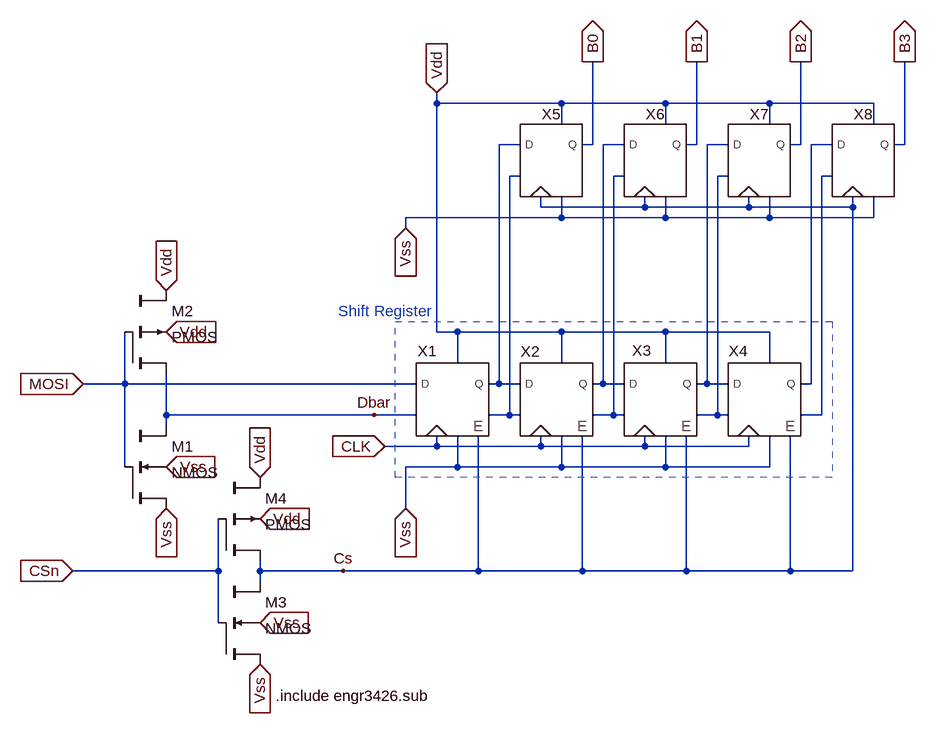
[diagram p0: schematic spi-interface.asc]
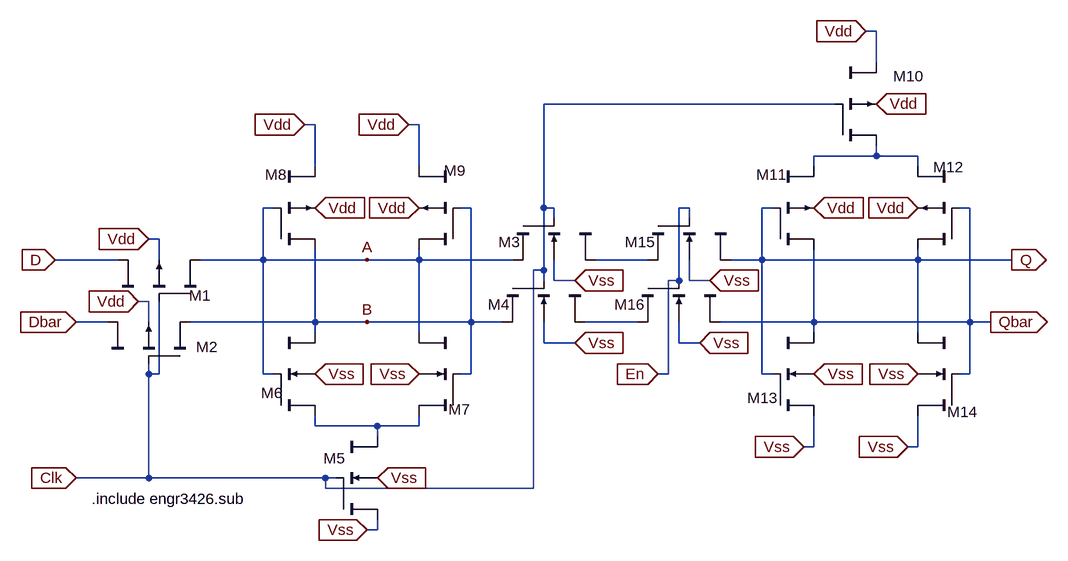
[diagram p1: sub-circuit dflipflop.asc]
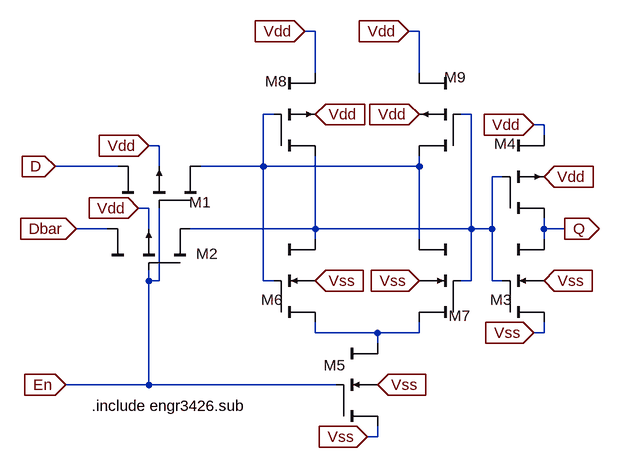
[diagram p2: sub-circuit dflipflopsimple.asc]
spi-interface.asc, the LTspice schematic file:
Version 4
SHEET 1 2428 892
WIRE 240 -272 240 -288
WIRE 432 -272 240 -272
WIRE 592 -272 432 -272
WIRE 752 -272 592 -272
WIRE 912 -272 752 -272
WIRE 432 -240 432 -272
WIRE 592 -240 592 -272
WIRE 752 -240 752 -272
WIRE 912 -240 912 -272
WIRE 368 -208 336 -208
WIRE 480 -208 480 -336
WIRE 480 -208 464 -208
WIRE 528 -208 496 -208
WIRE 640 -208 640 -336
WIRE 640 -208 624 -208
WIRE 688 -208 656 -208
WIRE 800 -208 800 -336
WIRE 800 -208 784 -208
WIRE 848 -208 816 -208
WIRE 960 -208 960 -336
WIRE 960 -208 944 -208
WIRE 368 -160 352 -160
WIRE 528 -160 512 -160
WIRE 688 -160 672 -160
WIRE 848 -160 832 -160
WIRE 400 -112 400 -128
WIRE 560 -112 560 -128
WIRE 560 -112 400 -112
WIRE 720 -112 720 -128
WIRE 720 -112 560 -112
WIRE 880 -112 880 -128
WIRE 880 -112 720 -112
WIRE 432 -96 432 -128
WIRE 432 -96 192 -96
WIRE 592 -96 592 -128
WIRE 592 -96 432 -96
WIRE 752 -96 752 -128
WIRE 752 -96 592 -96
WIRE 912 -96 912 -128
WIRE 912 -96 752 -96
WIRE 192 -80 192 -96
WIRE 240 80 240 -272
WIRE 272 80 240 80
WIRE 432 80 272 80
WIRE 592 80 432 80
WIRE 752 80 592 80
WIRE 272 128 272 80
WIRE 432 128 432 80
WIRE 592 128 592 80
WIRE 752 128 752 80
WIRE -240 160 -240 80
WIRE -240 160 -304 160
WIRE 208 160 -240 160
WIRE 336 160 336 -208
WIRE 336 160 320 160
WIRE 368 160 336 160
WIRE 496 160 496 -208
WIRE 496 160 480 160
WIRE 528 160 496 160
WIRE 656 160 656 -208
WIRE 656 160 640 160
WIRE 688 160 656 160
WIRE 816 160 816 -208
WIRE 816 160 800 160
WIRE -176 208 -176 144
WIRE 144 208 -176 208
WIRE 208 208 144 208
WIRE 352 208 352 -160
WIRE 352 208 320 208
WIRE 368 208 352 208
WIRE 512 208 512 -160
WIRE 512 208 480 208
WIRE 528 208 512 208
WIRE 672 208 672 -160
WIRE 672 208 640 208
WIRE 688 208 672 208
WIRE 832 208 832 -160
WIRE 832 208 800 208
WIRE -176 224 -176 208
WIRE 240 256 240 240
WIRE 240 256 160 256
WIRE 400 256 400 240
WIRE 400 256 240 256
WIRE 560 256 560 240
WIRE 560 256 400 256
WIRE 720 256 720 240
WIRE 720 256 560 256
WIRE -240 288 -240 160
WIRE 272 288 272 240
WIRE 272 288 192 288
WIRE 432 288 432 240
WIRE 432 288 272 288
WIRE 592 288 592 240
WIRE 592 288 432 288
WIRE 752 288 752 240
WIRE 752 288 592 288
WIRE 192 352 192 288
WIRE -96 448 -96 368
WIRE -96 448 -320 448
WIRE -32 448 -32 432
WIRE 96 448 -32 448
WIRE 304 448 304 240
WIRE 304 448 96 448
WIRE 464 448 464 240
WIRE 464 448 304 448
WIRE 624 448 624 240
WIRE 624 448 464 448
WIRE 784 448 784 240
WIRE 784 448 624 448
WIRE 880 448 880 -112
WIRE 880 448 784 448
WIRE -32 464 -32 448
WIRE -96 528 -96 448
FLAG 144 208 Dbar
FLAG 192 352 Vss
IOPIN 192 352 In
FLAG 240 -288 Vdd
IOPIN 240 -288 In
FLAG -304 160 MOSI
IOPIN -304 160 In
FLAG 160 256 CLK
IOPIN 160 256 In
FLAG -176 352 Vss
IOPIN -176 352 In
FLAG -176 288 Vss
IOPIN -176 288 In
FLAG -176 80 Vdd
IOPIN -176 80 In
FLAG -176 16 Vdd
IOPIN -176 16 In
FLAG 480 -336 B0
IOPIN 480 -336 Out
FLAG 640 -336 B1
IOPIN 640 -336 Out
FLAG 800 -336 B2
IOPIN 800 -336 Out
FLAG 960 -336 B3
IOPIN 960 -336 Out
FLAG -32 592 Vss
IOPIN -32 592 In
FLAG -32 528 Vss
IOPIN -32 528 In
FLAG -32 368 Vdd
IOPIN -32 368 In
FLAG -32 304 Vdd
IOPIN -32 304 In
FLAG -320 448 CSn
IOPIN -320 448 In
FLAG 192 -80 Vss
IOPIN 192 -80 In
FLAG 96 448 Cs
SYMBOL dflipflop 432 192 R0
WINDOW 0 -48 -66 Bottom 2
SYMATTR InstName X2
SYMBOL dflipflop 272 192 R0
WINDOW 0 -47 -67 Bottom 2
SYMATTR InstName X1
SYMBOL dflipflop 592 192 R0
WINDOW 0 -37 -68 Bottom 2
SYMATTR InstName X3
SYMBOL dflipflop 752 192 R0
WINDOW 0 -48 -67 Bottom 2
SYMATTR InstName X4
SYMBOL cktsym\\nmos4 -176 288 R0
SYMATTR InstName M1
SYMATTR Value2 l=.6u w=1.2u
SYMBOL cktsym\\pmos4 -176 80 R0
SYMATTR InstName M2
SYMATTR Value2 l=.6u w=1.2u
SYMBOL cktsym\\nmos4 -32 528 R0
SYMATTR InstName M3
SYMATTR Value2 l=.6u w=1.2u
SYMBOL cktsym\\pmos4 -32 368 R0
SYMATTR InstName M4
SYMATTR Value2 l=.6u w=1.2u
SYMBOL dflipflopsimple 432 -176 R0
SYMATTR InstName X5
SYMBOL dflipflopsimple 592 -176 R0
SYMATTR InstName X6
SYMBOL dflipflopsimple 752 -176 R0
SYMATTR InstName X7
SYMBOL dflipflopsimple 912 -176 R0
SYMATTR InstName X8
TEXT -8 640 Left 2 !.include engr3426.sub
TEXT 88 48 Left 2 ;Shift Register
RECTANGLE Normal 848 304 176 64 2

dflipflop.asc, the sub-circuit schematic file:
Version 4
SHEET 1 1276 680
WIRE 976 -432 960 -432
WIRE 976 -384 976 -432
WIRE 912 -320 464 -320
WIRE 112 -288 96 -288
WIRE 272 -288 256 -288
WIRE 976 -240 976 -256
WIRE 976 -240 880 -240
WIRE 1040 -240 976 -240
WIRE 112 -224 112 -288
WIRE 272 -224 272 -288
WIRE 880 -224 880 -240
WIRE 1040 -224 1040 -240
WIRE 48 -160 32 -160
WIRE 352 -160 336 -160
WIRE 464 -160 464 -320
WIRE 480 -160 464 -160
WIRE 688 -160 672 -160
WIRE 816 -160 800 -160
WIRE 1120 -160 1104 -160
WIRE 480 -144 480 -160
WIRE 688 -144 688 -160
WIRE -128 -112 -144 -112
WIRE -192 -80 -288 -80
WIRE -128 -80 -128 -112
WIRE 32 -80 32 -160
WIRE 32 -80 -64 -80
WIRE 192 -80 32 -80
WIRE 272 -80 272 -96
WIRE 272 -80 192 -80
WIRE 416 -80 272 -80
WIRE 624 -80 544 -80
WIRE 800 -80 800 -160
WIRE 800 -80 752 -80
WIRE 1040 -80 1040 -96
WIRE 1040 -80 800 -80
WIRE 1184 -80 1040 -80
WIRE 464 -64 464 -160
WIRE 464 -64 448 -64
WIRE 464 -48 464 -64
WIRE 480 -48 480 -80
WIRE 512 -48 480 -48
WIRE 672 -48 672 -160
WIRE 672 -48 656 -48
WIRE 688 -48 688 -80
WIRE 720 -48 688 -48
WIRE -144 -16 -160 -16
WIRE -208 16 -256 16
WIRE -144 16 -144 -16
WIRE 112 16 112 -96
WIRE 112 16 -80 16
WIRE 192 16 112 16
WIRE 352 16 352 -160
WIRE 352 16 192 16
WIRE 400 16 352 16
WIRE 608 16 528 16
WIRE 880 16 880 -96
WIRE 880 16 736 16
WIRE 1120 16 1120 -160
WIRE 1120 16 880 16
WIRE 1152 16 1120 16
WIRE 112 32 112 16
WIRE 272 32 272 -80
WIRE 880 32 880 16
WIRE 1040 32 1040 -80
WIRE 464 48 464 16
WIRE 512 48 464 48
WIRE 672 48 672 16
WIRE 704 48 672 48
WIRE -144 96 -144 80
WIRE -128 96 -128 -16
WIRE -128 96 -144 96
WIRE 32 96 32 -80
WIRE 48 96 32 96
WIRE 352 96 352 16
WIRE 352 96 336 96
WIRE 656 96 656 -48
WIRE 656 96 640 96
WIRE 800 96 800 -80
WIRE 816 96 800 96
WIRE 1120 96 1120 16
WIRE 1120 96 1104 96
WIRE 112 176 112 160
WIRE 208 176 112 176
WIRE 272 176 272 160
WIRE 272 176 208 176
WIRE 208 192 208 176
WIRE 880 208 880 160
WIRE 880 208 864 208
WIRE 1040 208 1040 160
WIRE 1040 208 1024 208
WIRE -144 256 -144 96
WIRE -144 256 -256 256
WIRE 128 256 -144 256
WIRE 144 256 128 256
WIRE 128 272 128 256
WIRE 448 272 448 -64
WIRE 448 272 128 272
WIRE 208 336 208 320
WIRE 208 336 192 336
FLAG 256 -288 Vdd
IOPIN 256 -288 In
FLAG 96 -288 Vdd
IOPIN 96 -288 In
FLAG 192 336 Vss
IOPIN 192 336 In
FLAG 272 96 Vss
IOPIN 272 96 In
FLAG 112 96 Vss
IOPIN 112 96 In
FLAG 272 -160 Vdd
IOPIN 272 -160 In
FLAG 112 -160 Vdd
IOPIN 112 -160 In
FLAG 208 256 Vss
IOPIN 208 256 In
FLAG -144 -112 Vdd
IOPIN -144 -112 In
FLAG -160 -16 Vdd
IOPIN -160 -16 In
FLAG 512 -48 Vss
IOPIN 512 -48 In
FLAG 512 48 Vss
IOPIN 512 48 In
FLAG 1040 96 Vss
IOPIN 1040 96 In
FLAG 880 96 Vss
IOPIN 880 96 In
FLAG 1040 -160 Vdd
IOPIN 1040 -160 In
FLAG 880 -160 Vdd
IOPIN 880 -160 In
FLAG 976 -320 Vdd
IOPIN 976 -320 In
FLAG 960 -432 Vdd
IOPIN 960 -432 In
FLAG -288 -80 D
IOPIN -288 -80 In
FLAG -256 16 Dbar
IOPIN -256 16 In
FLAG 1184 -80 Q
IOPIN 1184 -80 Out
FLAG 1152 16 Qbar
IOPIN 1152 16 Out
FLAG -256 256 Clk
IOPIN -256 256 In
FLAG 864 208 Vss
IOPIN 864 208 In
FLAG 1024 208 Vss
IOPIN 1024 208 In
FLAG 192 -80 A
FLAG 192 16 B
FLAG 720 -48 Vss
IOPIN 720 -48 In
FLAG 704 48 Vss
IOPIN 704 48 In
FLAG 640 96 En
IOPIN 640 96 In
SYMBOL cktsym\\pmos4 -144 16 R270
WINDOW 0 -38 73 VRight 2
WINDOW 3 16 16 Invisible 2
SYMATTR InstName M2
SYMATTR Value2 l=.6u w=1.2u
SYMBOL cktsym\\pmos4 -128 -80 R270
WINDOW 0 -55 46 VRight 2
WINDOW 3 16 16 Invisible 2
SYMATTR InstName M1
SYMATTR Value2 l=.6u w=1.2u
SYMBOL cktsym\\nmos4 464 16 R90
WINDOW 0 -27 52 VRight 2
WINDOW 3 16 16 Invisible 2
SYMATTR InstName M4
SYMATTR Value2 l=2.4u w=1.2u
SYMBOL cktsym\\nmos4 208 256 R0
WINDOW 0 -83 -30 Left 2
WINDOW 3 16 16 Invisible 2
SYMATTR InstName M5
SYMATTR Value2 l=.6u w=1.2u
SYMBOL cktsym\\nmos4 112 96 R0
WINDOW 0 -83 29 Left 2
WINDOW 3 16 16 Invisible 2
SYMATTR InstName M6
SYMATTR Value2 l=.6u w=1.2u
SYMBOL cktsym\\nmos4 272 96 M0
WINDOW 0 -79 54 Left 2
WINDOW 3 16 16 Invisible 2
SYMATTR InstName M7
SYMATTR Value2 l=.6u w=1.2u
SYMBOL cktsym\\pmos4 112 -160 R0
WINDOW 0 -77 -51 Left 2
WINDOW 3 16 16 Invisible 2
SYMATTR InstName M8
SYMATTR Value2 l=.6u w=1.2u
SYMBOL cktsym\\pmos4 272 -160 M0
WINDOW 0 -72 -57 Left 2
WINDOW 3 16 16 Invisible 2
SYMATTR InstName M9
SYMATTR Value2 l=.6u w=1.2u
SYMBOL cktsym\\pmos4 976 -320 R0
WINDOW 0 26 -43 Left 2
WINDOW 3 16 16 Invisible 2
SYMATTR InstName M10
SYMATTR Value2 l=.6u w=1.2u
SYMBOL cktsym\\nmos4 880 96 R0
WINDOW 0 -103 37 Left 2
WINDOW 3 16 16 Invisible 2
SYMATTR InstName M13
SYMATTR Value2 l=.6u w=1.2u
SYMBOL cktsym\\nmos4 1040 96 M0
WINDOW 0 -92 58 Left 2
WINDOW 3 16 16 Invisible 2
SYMATTR InstName M14
SYMATTR Value2 l=.6u w=1.2u
SYMBOL cktsym\\pmos4 880 -160 R0
WINDOW 0 -89 -51 Left 2
WINDOW 3 16 16 Invisible 2
SYMATTR InstName M11
SYMATTR Value2 l=.6u w=1.2u
SYMBOL cktsym\\pmos4 1040 -160 M0
WINDOW 0 -71 -63 Left 2
WINDOW 3 16 16 Invisible 2
SYMATTR InstName M12
SYMATTR Value2 l=.6u w=1.2u
SYMBOL cktsym\\nmos4 480 -80 R90
WINDOW 0 -27 52 VRight 2
WINDOW 3 16 16 Invisible 2
SYMATTR InstName M3
SYMATTR Value2 l=2.4u w=1.2u
SYMBOL cktsym\\nmos4 688 -80 R90
WINDOW 0 -27 52 VRight 2
WINDOW 3 16 16 Invisible 2
SYMATTR InstName M15
SYMATTR Value2 l=2.4u w=1.2u
SYMBOL cktsym\\nmos4 672 16 R90
WINDOW 0 -27 52 VRight 2
WINDOW 3 16 16 Invisible 2
SYMATTR InstName M16
SYMATTR Value2 l=2.4u w=1.2u
TEXT -232 288 Left 2 !.include engr3426.sub

dflipflopsimple.asc, the sub-circuit schematic file:
Version 4
SHEET 1 1276 680
WIRE 112 -288 96 -288
WIRE 272 -288 256 -288
WIRE 112 -224 112 -288
WIRE 272 -224 272 -288
WIRE 48 -160 32 -160
WIRE 352 -160 336 -160
WIRE 464 -144 448 -144
WIRE 464 -128 464 -144
WIRE -128 -112 -144 -112
WIRE -192 -80 -288 -80
WIRE -128 -80 -128 -112
WIRE 32 -80 32 -160
WIRE 32 -80 -64 -80
WIRE 272 -80 272 -96
WIRE 272 -80 32 -80
WIRE 400 -64 384 -64
WIRE -144 -16 -160 -16
WIRE -208 16 -256 16
WIRE -144 16 -144 -16
WIRE 112 16 112 -96
WIRE 112 16 -80 16
WIRE 352 16 352 -160
WIRE 352 16 112 16
WIRE 384 16 384 -64
WIRE 384 16 352 16
WIRE 464 16 464 0
WIRE 496 16 464 16
WIRE 112 32 112 16
WIRE 272 32 272 -80
WIRE 464 32 464 16
WIRE -144 96 -144 80
WIRE -128 96 -128 -16
WIRE -128 96 -144 96
WIRE 32 96 32 -80
WIRE 48 96 32 96
WIRE 352 96 352 16
WIRE 352 96 336 96
WIRE 384 96 384 16
WIRE 400 96 384 96
WIRE 112 176 112 160
WIRE 208 176 112 176
WIRE 272 176 272 160
WIRE 272 176 208 176
WIRE 464 176 464 160
WIRE 464 176 448 176
WIRE 208 192 208 176
WIRE -144 256 -144 96
WIRE -144 256 -272 256
WIRE 144 256 -144 256
WIRE 208 336 208 320
WIRE 208 336 192 336
FLAG 256 -288 Vdd
IOPIN 256 -288 In
FLAG 96 -288 Vdd
IOPIN 96 -288 In
FLAG 192 336 Vss
IOPIN 192 336 In
FLAG 272 96 Vss
IOPIN 272 96 In
FLAG 112 96 Vss
IOPIN 112 96 In
FLAG 272 -160 Vdd
IOPIN 272 -160 In
FLAG 112 -160 Vdd
IOPIN 112 -160 In
FLAG 208 256 Vss
IOPIN 208 256 In
FLAG -144 -112 Vdd
IOPIN -144 -112 In
FLAG -160 -16 Vdd
IOPIN -160 -16 In
FLAG -288 -80 D
IOPIN -288 -80 In
FLAG -256 16 Dbar
IOPIN -256 16 In
FLAG 496 16 Q
IOPIN 496 16 Out
FLAG -272 256 En
IOPIN -272 256 In
FLAG 464 96 Vss
IOPIN 464 96 In
FLAG 464 -64 Vdd
IOPIN 464 -64 In
FLAG 448 -144 Vdd
IOPIN 448 -144 In
FLAG 448 176 Vss
IOPIN 448 176 In
SYMBOL cktsym\\pmos4 -144 16 R270
WINDOW 0 -38 73 VRight 2
WINDOW 3 16 16 Invisible 2
SYMATTR InstName M2
SYMATTR Value2 l=.6u w=1.2u
SYMBOL cktsym\\pmos4 -128 -80 R270
WINDOW 0 -55 46 VRight 2
WINDOW 3 16 16 Invisible 2
SYMATTR InstName M1
SYMATTR Value2 l=.6u w=1.2u
SYMBOL cktsym\\nmos4 208 256 R0
WINDOW 0 -83 -30 Left 2
WINDOW 3 16 16 Invisible 2
SYMATTR InstName M5
SYMATTR Value2 l=.6u w=1.2u
SYMBOL cktsym\\nmos4 112 96 R0
WINDOW 0 -83 29 Left 2
WINDOW 3 16 16 Invisible 2
SYMATTR InstName M6
SYMATTR Value2 l=.6u w=1.2u
SYMBOL cktsym\\nmos4 272 96 M0
WINDOW 0 -79 54 Left 2
WINDOW 3 16 16 Invisible 2
SYMATTR InstName M7
SYMATTR Value2 l=.6u w=1.2u
SYMBOL cktsym\\pmos4 112 -160 R0
WINDOW 0 -77 -51 Left 2
WINDOW 3 16 16 Invisible 2
SYMATTR InstName M8
SYMATTR Value2 l=.6u w=1.2u
SYMBOL cktsym\\pmos4 272 -160 M0
WINDOW 0 -72 -57 Left 2
WINDOW 3 16 16 Invisible 2
SYMATTR InstName M9
SYMATTR Value2 l=.6u w=1.2u
SYMBOL cktsym\\nmos4 464 96 R0
WINDOW 0 -83 29 Left 2
WINDOW 3 16 16 Invisible 2
SYMATTR InstName M3
SYMATTR Value2 l=.6u w=1.2u
SYMBOL cktsym\\pmos4 464 -64 R0
WINDOW 0 -77 -51 Left 2
WINDOW 3 16 16 Invisible 2
SYMATTR InstName M4
SYMATTR Value2 l=.6u w=1.2u
TEXT -232 288 Left 2 !.include engr3426.sub

The netlist it stands for:
* spi-interface.asc
XX2 CLK N001 N005 Vdd Vss N002 N006 Cs dflipflop
XX1 CLK MOSI Dbar Vdd Vss N001 N005 Cs dflipflop
XX3 CLK N002 N006 Vdd Vss N003 N007 Cs dflipflop
XX4 CLK N003 N007 Vdd Vss N004 N008 Cs dflipflop
M1 Dbar MOSI Vss Vss NMOS l=.6u w=1.2u
M2 Dbar MOSI Vdd Vdd PMOS l=.6u w=1.2u
M3 Cs CSn Vss Vss NMOS l=.6u w=1.2u
M4 Cs CSn Vdd Vdd PMOS l=.6u w=1.2u
XX5 Cs N001 N005 Vdd Vss B0 dflipflopsimple
XX6 Cs N002 N006 Vdd Vss B1 dflipflopsimple
XX7 Cs N003 N007 Vdd Vss B2 dflipflopsimple
XX8 Cs N004 N008 Vdd Vss B3 dflipflopsimple

* block symbol definitions
.subckt dflipflop Clk D Dbar Vdd Vss Q Qbar En
M2 B Clk Dbar Vdd PMOS l=.6u w=1.2u
M1 A Clk D Vdd PMOS l=.6u w=1.2u
M4 N003 Clk B Vss NMOS l=2.4u w=1.2u
M5 N004 Clk Vss Vss NMOS l=.6u w=1.2u
M6 B A N004 Vss NMOS l=.6u w=1.2u
M7 A B N004 Vss NMOS l=.6u w=1.2u
M8 B A Vdd Vdd PMOS l=.6u w=1.2u
M9 A B Vdd Vdd PMOS l=.6u w=1.2u
M10 N001 Clk Vdd Vdd PMOS l=.6u w=1.2u
M13 Qbar Q Vss Vss NMOS l=.6u w=1.2u
M14 Q Qbar Vss Vss NMOS l=.6u w=1.2u
M11 Qbar Q N001 Vdd PMOS l=.6u w=1.2u
M12 Q Qbar N001 Vdd PMOS l=.6u w=1.2u
M3 N002 Clk A Vss NMOS l=2.4u w=1.2u
M15 Q En N002 Vss NMOS l=2.4u w=1.2u
M16 Qbar En N003 Vss NMOS l=2.4u w=1.2u
.include engr3426.sub
.ends dflipflop

.subckt dflipflopsimple En D Dbar Vdd Vss Q
M2 N002 En Dbar Vdd PMOS l=.6u w=1.2u
M1 N001 En D Vdd PMOS l=.6u w=1.2u
M5 N003 En Vss Vss NMOS l=.6u w=1.2u
M6 N002 N001 N003 Vss NMOS l=.6u w=1.2u
M7 N001 N002 N003 Vss NMOS l=.6u w=1.2u
M8 N002 N001 Vdd Vdd PMOS l=.6u w=1.2u
M9 N001 N002 Vdd Vdd PMOS l=.6u w=1.2u
M3 Q N002 Vss Vss NMOS l=.6u w=1.2u
M4 Q N002 Vdd Vdd PMOS l=.6u w=1.2u
.include engr3426.sub
.ends dflipflopsimple

.model NMOS NMOS
.model PMOS PMOS
.lib standard.mos
.include engr3426.sub
* Shift Register
.backanno
.end